# EAGLE design control_board (EAGLE 6.2)
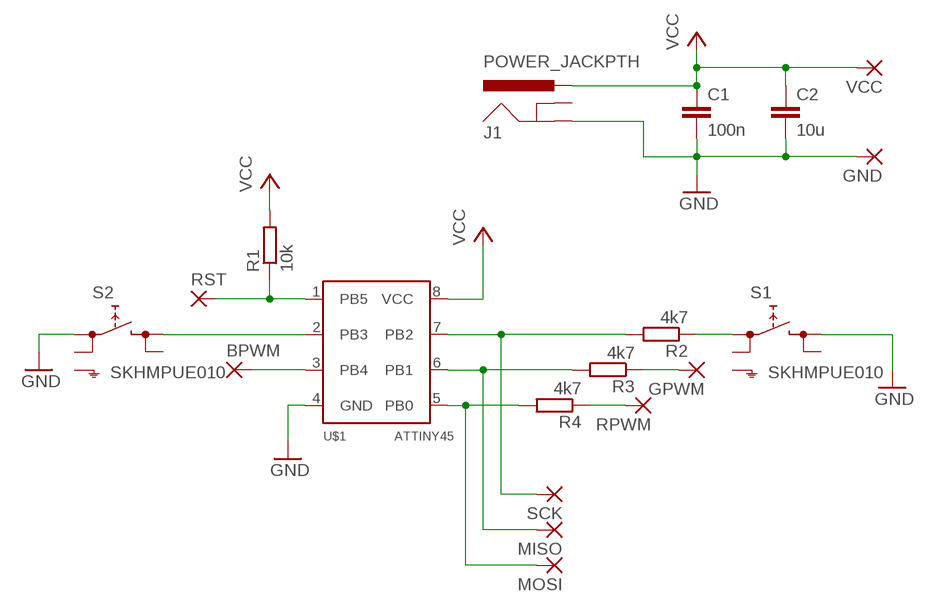
[diagram p0: schematic, sheet 1]

## Parts
BPWM  SMD5  [SMD2,54-5,08]
C1  100n  C-EUC1206  [C1206]
C2  10u  C-EUC1206  [C1206]
GND  SMD5  [SMD2,54-5,08]
GPWM  SMD5  [SMD2,54-5,08]
J1  POWER_JACKPTH  [POWER_JACK_PTH]
MISO  SMD2  [SMD1,27-2,54]
MOSI  SMD2  [SMD1,27-2,54]
R1  10k  R-EU_R1206  [R1206]
R2  4k7  R-EU_R1206  [R1206]
R3  4k7  R-EU_R1206  [R1206]
R4  4k7  R-EU_R1206  [R1206]
RPWM  SMD5  [SMD2,54-5,08]
RST  SMD2  [SMD1,27-2,54]
S1  SKHMPUE010  [SKHMPXE010]
S2  SKHMPUE010  [SKHMPXE010]
SCK  SMD2  [SMD1,27-2,54]
U$1  ATTINY45  [SOIC8]
VCC  SMD5  [SMD2,54-5,08]

## Nets
GND: C1.2 C2.2 GND.1(P) J1.GND S1.3(2.1) S2.1(1.1) U$1.4(GND)
N$1: S2.3(2.1) U$1.2(PB3)
N$2: BPWM.1(P) U$1.3(PB4)
N$3: MISO.1(P) R3.2 U$1.6(PB1)
N$4: MOSI.1(P) R4.2 U$1.5(PB0)
N$5: R2.2 SCK.1(P) U$1.7(PB2)
N$6: R1.1 RST.1(P) U$1.1(PB5)
N$7: R2.1 S1.1(1.1)
N$8: GPWM.1(P) R3.1
N$9: R4.1 RPWM.1(P)
VCC: C1.1 C2.1 J1.PWR R1.2 U$1.8(VCC) VCC.1(P)
Unconnected: J1.GNDBREAK S1.2(1.2) S1.4(2.2) S1.5(SH) S2.2(1.2) S2.4(2.2) S2.5(SH)

## Library data of the parts
BPWM GND GPWM RPWM VCC = wirepad:SMD5: SMD PAD
C1 C2 = resistor:C-EU: CAPACITOR, European symbol
J1 = SparkFun:POWER_JACK: Power Jack This is the standard 5.5mm barrel jack for power. The PTH is the most common, proven, reliable, footprint. All others are experimental. The Slot footprint only works if the mill layer is transmitted to the PCB fab house so be warned. Spark Fun Electronics SKU : PRT-00119. Mating wall wart : TOL-00298 (and others)
MISO MOSI RST SCK = wirepad:SMD2: SMD PAD
R1-R4 = resistor:R-EU_: RESISTOR, European symbol
S1 S2 = switch:SKHMP*E010: 6.2 X 6.5mm TACT Switch (SMD) Source: http://www3.alps.co.jp/WebObjects/catalog.woa/PDF/E/Switch/Tact/SKHM/SKHM.PDF
U$1 = attiny45:ATTINY45

## Board
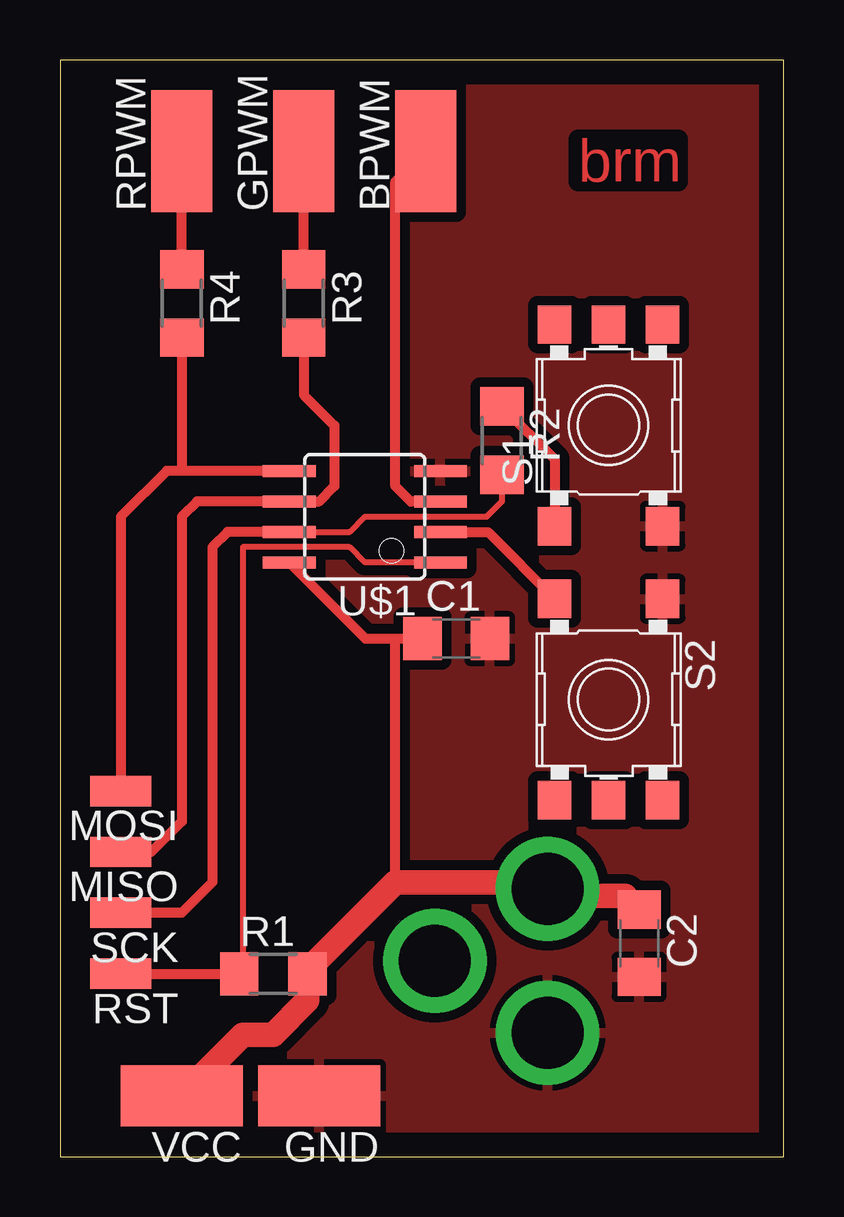
[diagram p1: board, top side]
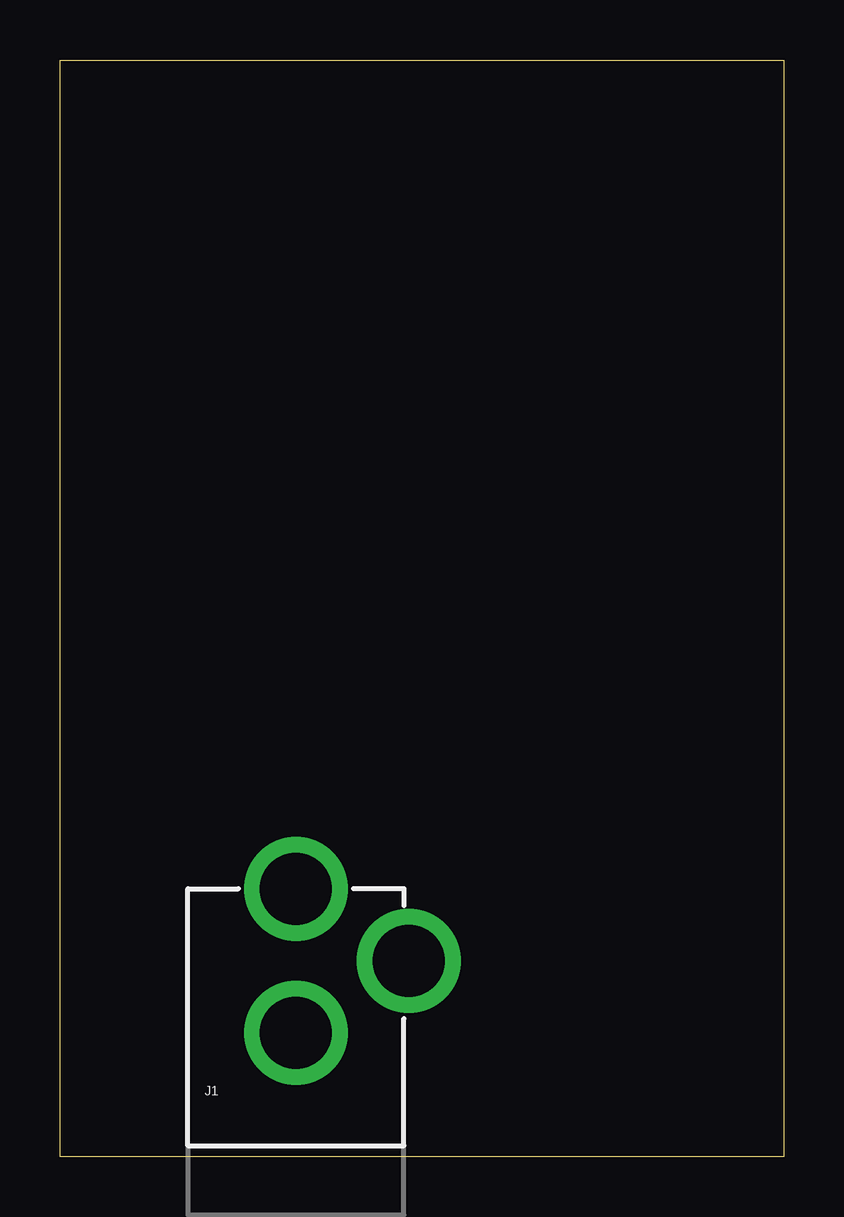
[diagram p2: board, bottom side, seen from below]

Size 30.15 x 45.71 mm. Coordinates in mm from the lower left corner, seen from the top.
Outline: 0,0 30.15,0 30.15,45.71 0,45.71 0,0
Copper layers (1*16): Top 0.035mm / dielectric 1.5mm / Bottom 0.035mm
Design rules: minimum track width 10mil, minimum drill 24mil, track to track 16mil, track to pad 16mil, pad to pad 16mil, via to via 16mil, smd to smd 16mil, copper to edge 40mil, drill to drill 8mil, minimum pad ring 10mil, minimum via ring 8mil, stop-mask expansion 4mil, vias tented up to drill 0mil, thermal gap 10mil

### Footprints (pad centres in the part's own frame; a part is rotated, then mirrored left to right if it is on the bottom)
SMD2,54-5,08 = smd 2.54 x 5.08: 1 0,0
C1206 = smd 1.6 x 1.8: 1 -1.4,0; 2 1.4,0
POWER_JACK_PTH = drill 2.997 pad 4.318: GND 0,7.7; GNDBREAK 4.7,10.7; PWR 0,13.7
SMD1,27-2,54 = smd 1.27 x 2.54: 1 0,0
R1206 = smd 1.6 x 1.803: 1 -1.422,0; 2 1.422,0
SKHMPXE010 = smd 1.6 x 1.4: 1 -4.2,2.25; 2 4.2,2.25; 3 -4.2,-2.25; 4 4.2,-2.25; 5 4.2,0
SOIC8 = smd 0.5 x 2.2: 1 -1.905,-3.154; 2 -0.645,-3.154; 3 0.625,-3.154; 4 1.895,-3.154; 5 1.905,3.154; 6 0.635,3.154; 7 -0.635,3.154; 8 -1.905,3.154

### Placement (x,y rotation side)
BPWM  15.24,41.91 0 top
C1  16.51,21.59 0 top
C2  24.13,8.89 270 top
GND  10.79,2.54 90 top
GPWM  10.16,41.91 0 top
J1  20.32,-2.54 0 bottom
MISO  2.54,12.7 90 top
MOSI  2.54,15.24 90 top
R1  8.89,7.62 0 top
R2  18.41,29.84 270 top
R3  10.16,35.56 270 top
R4  5.08,35.56 270 top
RPWM  5.08,41.91 0 top
RST  2.54,7.62 90 top
S1  22.86,30.48 90 top
S2  22.86,19.05 270 top
SCK  2.54,10.16 90 top
U$1  12.7,26.67 90 top
VCC  5.08,2.54 90 top

### Tracks (layer width: path | path; a pad name or v marks a point on that pad's centre or on a via)
GND
  pour Top: -1.27,-1.27 31.75,-1.27 31.75,46.99 -1.27,46.99
N$1
  Top 0.406: U$1.2 17.84,26.02 S2.3
N$2
  Top 0.406: U$1.3 14.62,27.3 13.97,27.94 13.97,40.64 BPWM.1
N$3
  Top 0.406: R3.2 10.16,31.75 11.43,30.48 11.43,27.94 10.79,27.3 U$1.6 5.71,27.3 5.08,26.67 5.08,13.97 3.81,12.7 MISO.1
N$4
  Top 0.406: U$1.5 5.08,28.57 | 5.08,28.57 4.45,28.57 2.54,26.67 MOSI.1 | R4.2 5.08,28.57
N$5
  Top 0.254: U$1.7 12.06,26.04 12.7,26.67 17.78,26.67 18.41,27.3 R2.2
  Top 0.406: U$1.7 6.99,26.04 6.35,25.4 6.35,11.43 5.08,10.16 SCK.1
N$6
  Top 0.254: U$1.1 12.7,24.77 12.06,25.4 7.62,25.4 7.62,7.77
  Top 0.406: 7.62,7.77 R1.1 RST.1
N$7
  Top 0.406: R2.1 20.61,29.07 S1.1
N$8
  Top 0.406: R3.1 GPWM.1
N$9
  Top 0.406: R4.1 RPWM.1
N$10
  cutout Top: 8.89,6.99 10.16,6.99 10.16,10.16 12.7,12.7 12.7,20.32 8.89,22.86
VCC
  Top 0.406: U$1.8 12.72,21.59 13.97,21.59 | 13.97,21.59 C1.1 | R1.2 10.31,7.77 | 23.26,11.16 23.56,10.86 C2.1 | 13.97,11.43 13.97,21.59
  Top 1.016: VCC.1 7.62,5.08 8.89,5.08 10.31,6.5 R1.2 | 23.56,10.86 20.62,10.86 J1.PWR 20.05,11.43 13.97,11.43 10.31,7.77

### Text on the board
Top: brm